# Altium schematic sheet Sonar.SchDoc
size A
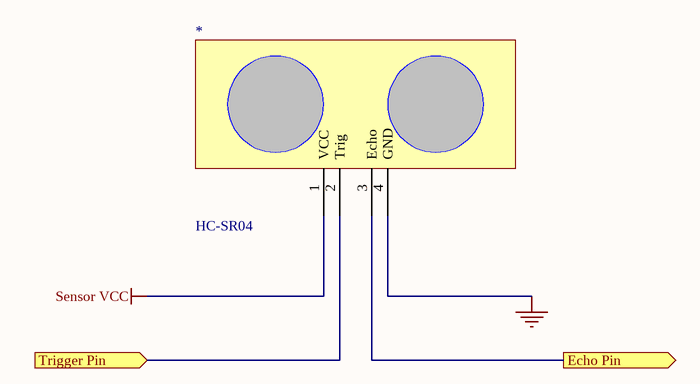
[diagram p0: Sonar.SchDoc]

## Parts
*  HC-SR04

## Ports
Echo Pin (out), Trigger Pin (in)

## Nets
GND: *.4(GND)
Sensor VCC: *.1(VCC)
Echo Pin: *.3(Echo) ; port Echo Pin
Trigger Pin: *.2(Trig) ; port Trigger Pin